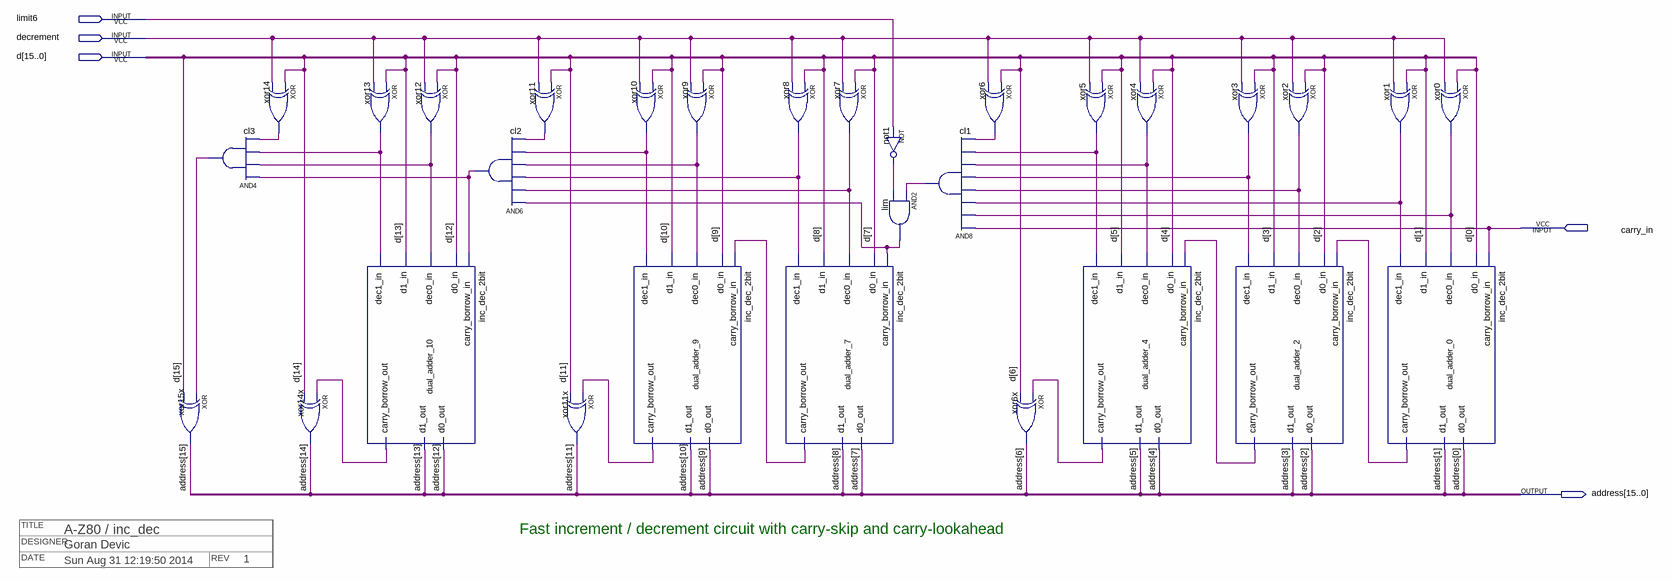
[diagram p0: schematic sheet]
// Quartus schematic inc_dec.bdf as structural Verilog: 30 symbols, 5 pins
// Title block: DATE: Sun Aug 31 12:19:50 2014; DESIGNER: Goran Devic; REV: 1; TITLE: A-Z80 / inc_dec
module inc_dec (
  input  limit6,
  input  decrement,
  input  [15:0] d,
  input  carry_in,
  output [15:0] address
);

  wire cl1_out, cl2_out, cl3_out, dual_adder_0_carry_borrow_out, dual_adder_2_carry_borrow_out,
       dual_adder_4_carry_borrow_out, dual_adder_7_carry_borrow_out, dual_adder_9_carry_borrow_out,
       dual_adder_10_carry_borrow_out, lim_out, not1_out, xor0_out, xor1_out, xor2_out, xor3_out, xor4_out,
       xor5_out, xor6_out, xor7_out, xor8_out, xor9_out, xor10_out, xor11_out, xor12_out, xor13_out,
       xor14_out;

  xor xor15x (address[15], cl3_out, d[15]);
  and cl3 (cl3_out, cl2_out, xor12_out, xor13_out, xor14_out);
  xor xor14 (xor14_out, d[14], decrement);
  xor xor14x (address[14], dual_adder_10_carry_borrow_out, d[14]);
  xor xor13 (xor13_out, d[13], decrement);
  inc_dec_2bit dual_adder_10 (
    .carry_borrow_in(cl2_out), .d1_in(d[13]), .d0_in(d[12]), .dec1_in(xor13_out), .dec0_in(xor12_out),
    .carry_borrow_out(dual_adder_10_carry_borrow_out), .d1_out(address[13]), .d0_out(address[12]));
  xor xor12 (xor12_out, d[12], decrement);
  and cl2 (cl2_out, lim_out, xor7_out, xor8_out, xor9_out, xor10_out, xor11_out);
  xor xor11 (xor11_out, d[11], decrement);
  xor xor11x (address[11], dual_adder_9_carry_borrow_out, d[11]);
  xor xor10 (xor10_out, d[10], decrement);
  inc_dec_2bit dual_adder_9 (
    .carry_borrow_in(dual_adder_7_carry_borrow_out), .d1_in(d[10]), .d0_in(d[9]), .dec1_in(xor10_out),
    .dec0_in(xor9_out), .carry_borrow_out(dual_adder_9_carry_borrow_out), .d1_out(address[10]),
    .d0_out(address[9]));
  xor xor9 (xor9_out, d[9], decrement);
  xor xor8 (xor8_out, d[8], decrement);
  inc_dec_2bit dual_adder_7 (
    .carry_borrow_in(lim_out), .d1_in(d[8]), .d0_in(d[7]), .dec1_in(xor8_out), .dec0_in(xor7_out),
    .carry_borrow_out(dual_adder_7_carry_borrow_out), .d1_out(address[8]), .d0_out(address[7]));
  xor xor7 (xor7_out, d[7], decrement);
  not not1 (not1_out, limit6);
  and lim (lim_out, cl1_out, not1_out);
  and cl1 (cl1_out, carry_in, xor0_out, xor1_out, xor2_out, xor3_out, xor4_out, xor5_out, xor6_out);
  xor xor6 (xor6_out, d[6], decrement);
  xor xor6x (address[6], dual_adder_4_carry_borrow_out, d[6]);
  xor xor5 (xor5_out, d[5], decrement);
  inc_dec_2bit dual_adder_4 (
    .carry_borrow_in(dual_adder_2_carry_borrow_out), .d1_in(d[5]), .d0_in(d[4]), .dec1_in(xor5_out),
    .dec0_in(xor4_out), .carry_borrow_out(dual_adder_4_carry_borrow_out), .d1_out(address[5]),
    .d0_out(address[4]));
  xor xor4 (xor4_out, d[4], decrement);
  xor xor3 (xor3_out, d[3], decrement);
  inc_dec_2bit dual_adder_2 (
    .carry_borrow_in(dual_adder_0_carry_borrow_out), .d1_in(d[3]), .d0_in(d[2]), .dec1_in(xor3_out),
    .dec0_in(xor2_out), .carry_borrow_out(dual_adder_2_carry_borrow_out), .d1_out(address[3]),
    .d0_out(address[2]));
  xor xor2 (xor2_out, d[2], decrement);
  xor xor1 (xor1_out, d[1], decrement);
  inc_dec_2bit dual_adder_0 (
    .carry_borrow_in(carry_in), .d1_in(d[1]), .d0_in(d[0]), .dec1_in(xor1_out), .dec0_in(xor0_out),
    .carry_borrow_out(dual_adder_0_carry_borrow_out), .d1_out(address[1]), .d0_out(address[0]));
  xor xor0 (xor0_out, d[0], decrement);

  // Notes on the sheet:
  //   Fast increment / decrement circuit with carry-skip and carry-lookahead
endmodule
